# EAGLE design dubber (EAGLE 7.6.0)
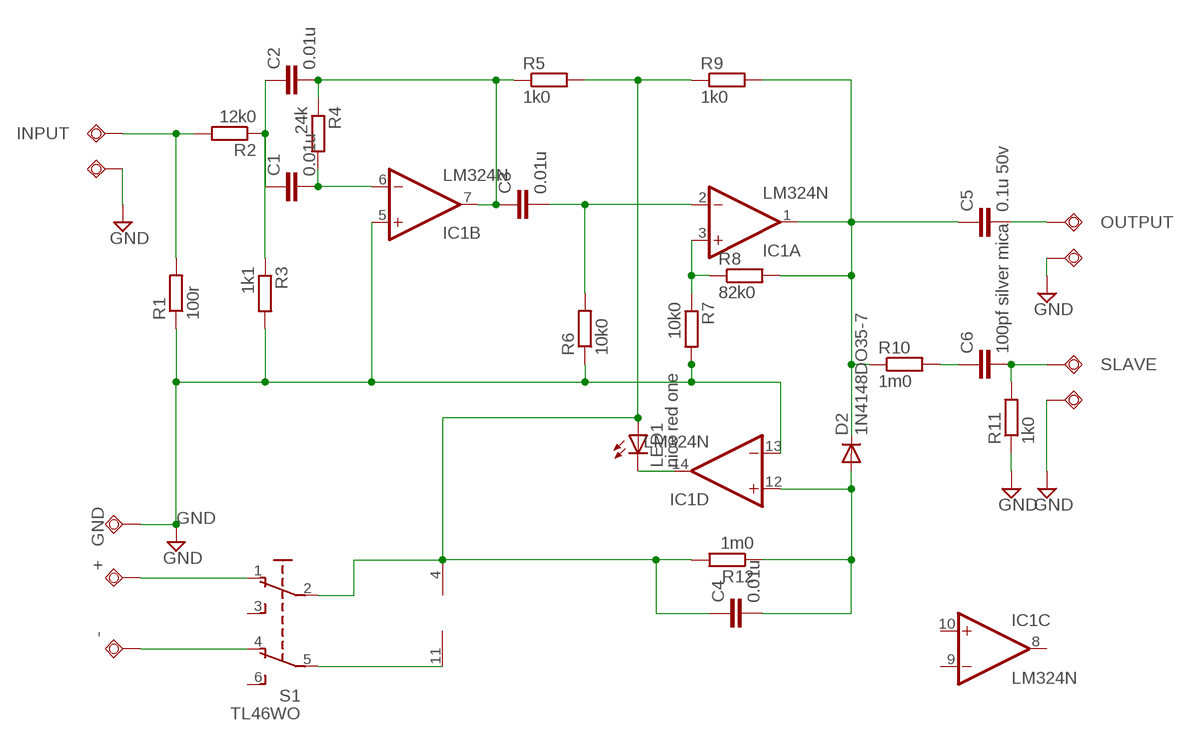
[diagram p0: schematic, sheet 1]

## Parts
+  TPSQPAD1-13Y  [P1-13Y]
-  TPSQPAD1-13Y  [P1-13Y]
C1  0.01u  C-EU025-025X050  [C025-025X050]
C2  0.01u  C-EU025-025X050  [C025-025X050]
C3  0.01u  C-EU025-025X050  [C025-025X050]
C4  0.01u  C-EU025-025X050  [C025-025X050]
C5  0.1u 50v  C-EU025-025X050  [C025-025X050]
C6  100pf silver mica  C-EU025-025X050  [C025-025X050]
D2  1N4148DO35-7  [DO35-7]
GND  TPSQPAD1-13Y  [P1-13Y]
IC1  LM324N  [DIL14]
INPUT  TPSQPAD1-13Y  [P1-13Y]
LED1  nice red one  LED5MM  [LED5MM]
OUTPUT  TPSQPAD1-13Y  [P1-13Y]
P1-G  TPSQPAD1-13Y  [P1-13Y]
P2-G  TPSQPAD1-13Y  [P1-13Y]
P3-G  TPSQPAD1-13Y  [P1-13Y]
R1  100r  R-EU_0207/10  [0207/10]
R2  12k0  R-EU_0207/10  [0207/10]
R3  1k1  R-EU_0207/10  [0207/10]
R4  24k  R-EU_0207/10  [0207/10]
R5  1k0  R-EU_0207/10  [0207/10]
R6  10k0  R-EU_0207/10  [0207/10]
R7  10k0  R-EU_0207/10  [0207/10]
R8  82k0  R-EU_0207/10  [0207/10]
R9  1k0  R-EU_0207/10  [0207/10]
R10  1m0  R-EU_0207/10  [0207/10]
R11  1k0  R-EU_0207/10  [0207/10]
R12  1m0  R-EU_0207/10  [0207/10]
S1  TL46WO  [TL4XWO]
SLAVE  TPSQPAD1-13Y  [P1-13Y]

## Nets
GND: GND.TP IC1.5(B:+IN) IC1.13(D:-IN) P1-G.TP P2-G.TP P3-G.TP R1.1 R3.2 R6.1 R7.2 R11.1
N$1: C1.1 C2.1 R2.1 R3.1
N$2: C2.2 C3.1 IC1.7(B:OUT) R4.1 R5.1
N$3: C6.1 R10.2
N$4: +.TP S1.1(O)
N$5: -.TP S1.4(O1)
N$9: C4.2 D2.A IC1.12(D:+IN) R12.1
N$10: C5.1 D2.C IC1.1(A:OUT) R8.2 R9.2 R10.1
N$12: IC1.14(D:OUT) LED1.K(C)
N$14: C5.2 OUTPUT.TP
N$16: C1.2 IC1.6(B:-IN) R4.2
N$17: INPUT.TP R1.2 R2.2
N$18: C3.2 IC1.2(A:-IN) R6.2
N$20: IC1.3(A:+IN) R7.1 R8.1
N$21: C6.2 R11.2 SLAVE.TP
V+: C4.1 IC1.4(P:V+) LED1.A R5.2 R9.1 R12.2 S1.2(P)
V-: IC1.11(P:V-) S1.5(P1)
Unconnected: IC1.8(C:OUT) IC1.9(C:-IN) IC1.10(C:+IN) S1.3(S) S1.6(S1)

## Library data of the parts
+ - GND INPUT OUTPUT P1-G P2-G P3-G SLAVE = testpad:TPSQ: Test pad
C1-C6 = rcl:C-EU: CAPACITOR, European symbol
D2 = diode:1N4148: DIODE high speed (Philips)
IC1 = linear:LM324: OP AMP
LED1 = led:LED: LED OSRAM: - CHIPLED LG R971, LG N971, LY N971, LG Q971, LY Q971, LO R971, LY R971 LH N974, LH R974 LS Q976, LO Q976, LY Q976 LO Q996 - Hyper CHIPLED LW Q18S LB Q993, LB Q99A, LB R99A - SideLED LS A670, LO A670, LY A670, LG A670, LP A670 LB A673, LV A673, LT A673, LW A673 LH A674 LY A675 LS A676, LA A676, LO A676, LY A676, LW A676 LS A679, LY A679, LG A679 - Hyper Micro SIDELED® LS Y876, LA Y876, LO Y876, LY Y876 LT Y87S - SmartLED LW L88C, LW L88S LB L89C, LB L89S, LG L890 LS L89K, LO L89K, LY L89K LS L896, LA L896, LO L896, LY L896 - TOPLED LS T670, LO T670, LY T670, LG T670, LP T670 LSG T670, LSP T670, LSY T670, LOP T670, LYG T670 LG T671, LOG T671, LSG T671 LB T673, LV T673, LT T673, LW T673 LH T674 LS T676, LA T676, LO T676, LY T676, LB T676, LH T676, LSB T676, LW T676 LB T67C, LV T67C, LT T67C, LS T67K, LO T67K, LY T67K, LW E67C LS E67B, LA E67B, LO E67B, LY E67B, LB E67C, LV E67C, LT E67C LW T67C LS T679, LY T679, LG T679 LS T770, LO T770, LY T770, LG T770, LP T770 LB T773, LV T773, LT T773, LW T773 LH T774 LS E675, LA E675, LY E675, LS T675 LS T776, LA T776, LO T776, LY T776, LB T776 LHGB T686 LT T68C, LB T68C - Hyper Mini TOPLED® LB M676 - Mini TOPLED Santana® LG M470 LS M47K, LO M47K, LY M47K Source: http://www.osram.convergy.de LUXEON: - LUMILED® LXK2-PW12-R00, LXK2-PW12-S00, LXK2-PW14-U00, LXK2-PW14-V00 LXK2-PM12-R00, LXK2-PM12-S00, LXK2-PM14-U00 LXK2-PE12-Q00, LXK2-PE12-R00, LXK2-PE12-S00, LXK2-PE14-T00, LXK2-PE14-U00 LXK2-PB12-K00, LXK2-PB12-L00, LXK2-PB12-M00, LXK2-PB14-N00, LXK2-PB14-P00, LXK2-PB14-Q00 LXK2-PR12-L00, LXK2-PR12-M00, LXK2-PR14-Q00, LXK2-PR14-R00 LXK2-PD12-Q00, LXK2-PD12-R00, LXK2-PD12-S00 LXK2-PH12-R00, LXK2-PH12-S00 LXK2-PL12-P00, LXK2-PL12-Q00, LXK2-PL12-R00 Source: www.luxeon.com KINGBRIGHT: KA-3528ASYC Source: www.kingbright.com
R1-R12 = rcl:R-EU_: RESISTOR, European symbol
S1 = switch:TL46WO: TINY SWITCH ON - ON Source: http://www2.produktinfo.conrad.com/datenblaetter/700000-724999/705152-da-01-de-Subminiaturschalter_TL_36WO.pdf

## Board
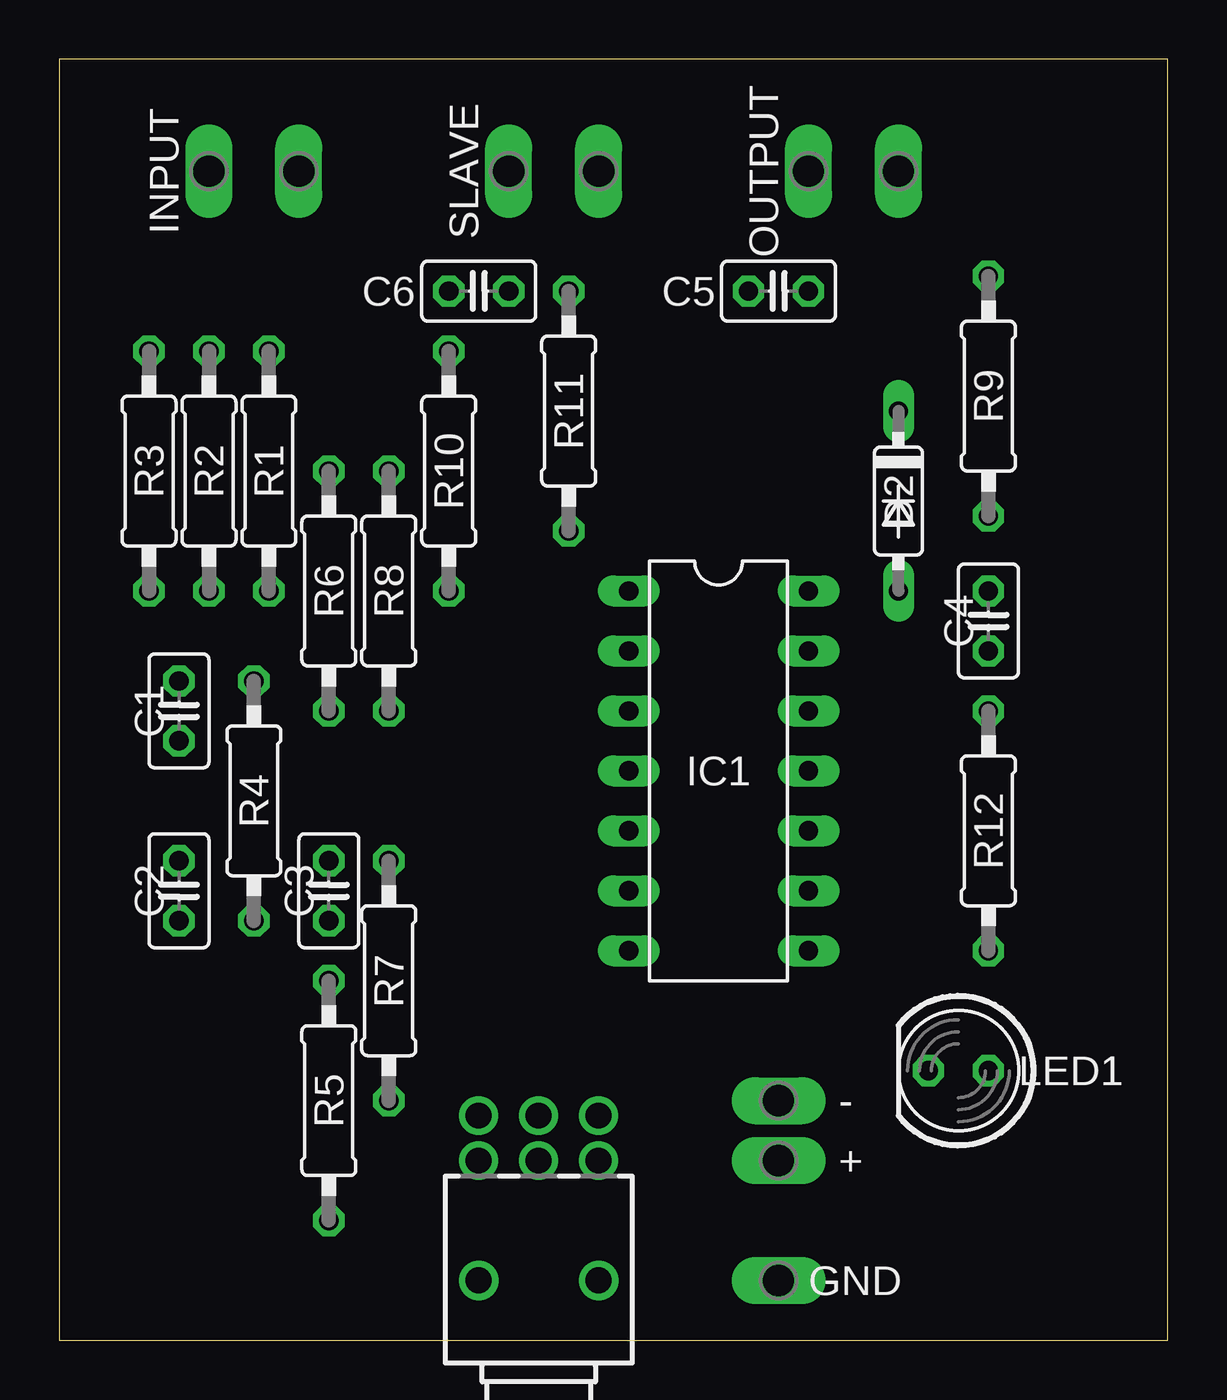
[diagram p1: board, top side]
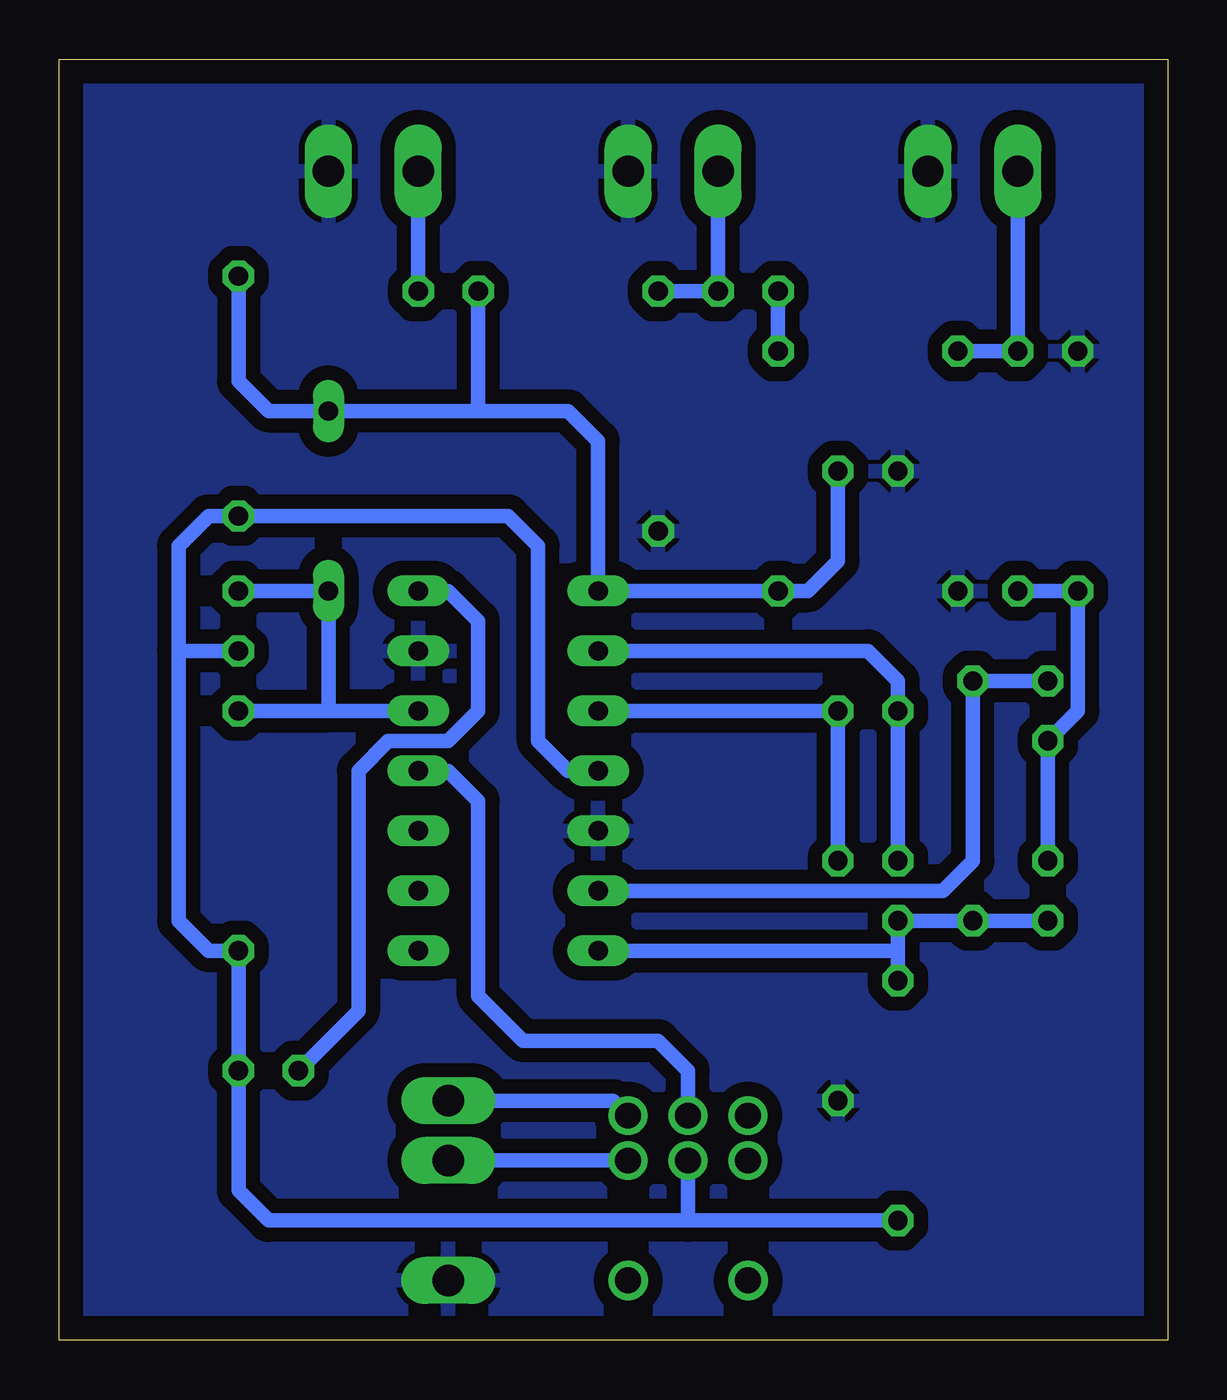
[diagram p2: board, bottom side, seen from below]

Size 46.97 x 54.28 mm. Coordinates in mm from the lower left corner, seen from the top.
Outline: 0,0 46.97,0 46.97,54.28 0,54.28 0,0
Copper layers (1*16): Top 0.035mm / dielectric 1.5mm / Bottom 0.035mm
Design rules "default": minimum track width 10mil, minimum drill 24mil, track to track 8mil, track to pad 8mil, pad to pad 8mil, via to via 8mil, smd to smd 8mil, copper to edge 40mil, drill to drill 8mil, minimum pad ring 10mil, minimum via ring 8mil, stop-mask expansion 4mil, vias tented up to drill 0mil, thermal gap 10mil

### Footprints (pad centres in the part's own frame; a part is rotated, then mirrored left to right if it is on the bottom)
P1-13Y = drill 1.321 pad 1.905 long: TP 0,0
C025-025X050 = drill 0.813 octagon: 1 -1.27,0; 2 1.27,0
DO35-7 = drill 0.813 long: A 3.81,0; C -3.81,0
DIL14 = drill 0.813 long: 1 -7.62,-3.81; 2 -5.08,-3.81; 3 -2.54,-3.81; 4 0,-3.81; 5 2.54,-3.81; 6 5.08,-3.81; 7 7.62,-3.81; 8 7.62,3.81; 9 5.08,3.81; 10 2.54,3.81; 11 0,3.81; 12 -2.54,3.81; 13 -5.08,3.81; 14 -7.62,3.81
LED5MM = drill 0.813 octagon: A -1.27,0; K 1.27,0
0207/10 = drill 0.813 octagon: 1 -5.08,0; 2 5.08,0
TL4XWO = drill 1.1 pad 1.422: 1 -2.54,-5.08; 2 0,-5.08; 3 2.54,-5.08; 4 -2.54,-6.985; 5 0,-6.985; 6 2.54,-6.985 | drill 1.1 pad 1.676: M1 -2.54,0; M2 2.54,0

### Placement (x,y rotation side)
+  30.48,7.62 270 top
-  30.48,10.16 270 top
C1  5.08,26.67 90 top
C2  5.08,19.05 270 top
C3  11.43,19.05 90 top
C4  39.37,30.48 90 top
C5  30.48,44.45 0 top
C6  17.78,44.45 0 top
D2  35.56,35.56 270 top
GND  30.48,2.54 270 top
IC1  27.94,24.13 270 top
INPUT  6.35,49.53 0 top
LED1  38.1,11.43 180 top
OUTPUT  31.75,49.53 0 top
P1-G  10.16,49.53 0 top
P2-G  35.56,49.53 0 top
P3-G  22.86,49.53 0 top
R1  8.89,36.83 90 top
R2  6.35,36.83 90 top
R3  3.81,36.83 90 top
R4  8.26,22.86 90 top
R5  11.43,10.16 270 top
R6  11.43,31.75 270 top
R7  13.97,15.24 270 top
R8  13.97,31.75 90 top
R9  39.37,40.01 90 top
R10  16.51,36.83 90 top
R11  21.59,39.37 90 top
R12  39.37,21.59 270 top
S1  20.32,2.54 180 top
SLAVE  19.05,49.53 0 top

### Tracks (layer width: path | path; a pad name or v marks a point on that pad's centre or on a via)
GND
  pour Bottom (isolate 0.61): 0,54.61 46.99,54.61 46.99,0 0,0
N$1
  Bottom 0.61: C2.1 C1.1 3.81,26.67 R3.1 R2.1
N$2
  Bottom 0.61: C2.2 R4.1 C3.1 11.43,16.51 | 11.43,16.51 R5.1 | IC1.7 11.43,16.51
N$3
  Bottom 0.61: C6.1 R10.2
N$4
  Bottom 0.61: S1.1 +.TP
N$5
  Bottom 0.61: S1.4 23.5,10.16 -.TP
N$9
  Bottom 0.61: IC1.12 35.56,26.67 | 35.56,26.67 D2.A C4.2 | R12.1 35.56,26.67
N$10
  Bottom 0.61: 29.21,39.37 D2.C 38.1,39.37 39.37,40.64 R9.2 | C5.1 29.21,39.37 | R8.2 13.97,33.02 15.24,31.75 R10.1 IC1.1 24.13,38.1 25.4,39.37 29.21,39.37
N$12
  Bottom 0.61: IC1.14 30.48,31.75 29.21,30.48 29.21,26.67 30.48,25.4 33.02,25.4 34.29,24.13 34.29,13.97 LED1.K
N$14
  Bottom 0.61: OUTPUT.TP C5.2
N$16
  Bottom 0.61: C1.2 R4.2 8.26,20.32 9.53,19.05 IC1.6
N$17
  Bottom 0.61: INPUT.TP R2.2 R1.2
N$18
  Bottom 0.61: IC1.2 12.7,29.21 11.43,27.94 R6.2 C3.2
N$20
  Bottom 0.61: R7.1 R8.1 IC1.3
N$21
  Bottom 0.61: SLAVE.TP C6.2 R11.2
V+
  Bottom 0.61: IC1.4 25.4,24.13 26.67,25.4 26.67,33.66 27.94,34.92 R9.1 40.64,34.92 41.91,33.66 41.91,29.21 | S1.2 20.32,5.08 | 20.32,5.08 38.1,5.08 39.37,6.35 LED1.A R12.2 40.64,16.51 41.91,17.78 41.91,29.21 | R5.2 20.32,5.08 | C4.1 41.91,29.21
V-
  Bottom 0.61: S1.5 20.32,11.43 21.59,12.7 27.3,12.7 29.21,14.61 29.21,22.86 30.48,24.13 IC1.11